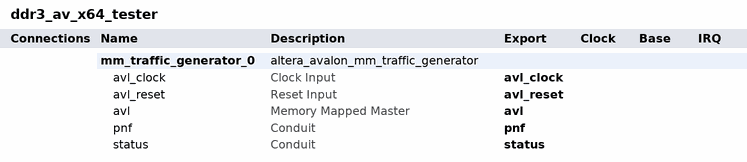
[diagram p0: system contents]
# Platform Designer (Qsys) system ddr3_av_x64_tester, Cyclone V 5CGXFC7D7F31C8
# Parameters at their usual value, and those the tool derives, are not listed.
package require -exact qsys 16.1
create_system ddr3_av_x64_tester
set_project_property DEVICE_FAMILY {Cyclone V}
set_project_property DEVICE 5CGXFC7D7F31C8

add_instance mm_traffic_generator_0 altera_avalon_mm_traffic_generator 16.1
set_instance_property mm_traffic_generator_0 AUTO_EXPORT true
set_instance_parameter_value mm_traffic_generator_0 CUT_NEW_FAMILY_TIMING true
set_instance_parameter_value mm_traffic_generator_0 DISABLE_CHILD_MESSAGING false
set_instance_parameter_value mm_traffic_generator_0 ENABLE_CTRL_AVALON_INTERFACE true
set_instance_parameter_value mm_traffic_generator_0 ENABLE_EMIT_BFM_MASTER false
set_instance_parameter_value mm_traffic_generator_0 HARD_EMIF false
set_instance_parameter_value mm_traffic_generator_0 HHP_HPS false
set_instance_parameter_value mm_traffic_generator_0 HHP_HPS_SIMULATION false
set_instance_parameter_value mm_traffic_generator_0 HHP_HPS_VERIFICATION false
set_instance_parameter_value mm_traffic_generator_0 HPS_PROTOCOL DEFAULT
set_instance_parameter_value mm_traffic_generator_0 IS_ES_DEVICE false
set_instance_parameter_value mm_traffic_generator_0 PARSE_FRIENDLY_DEVICE_FAMILY_PARAM_VALID false
set_instance_parameter_value mm_traffic_generator_0 SPEED_GRADE 2
set_instance_parameter_value mm_traffic_generator_0 TG_AVL_ADDR_WIDTH_IN 23
set_instance_parameter_value mm_traffic_generator_0 TG_AVL_DATA_WIDTH_IN 64
set_instance_parameter_value mm_traffic_generator_0 TG_AVL_MAX_SIZE 2
set_instance_parameter_value mm_traffic_generator_0 TG_AVL_SYMBOL_WIDTH 8
set_instance_parameter_value mm_traffic_generator_0 TG_BLOCK_RW_BLOCK_SIZE 8
set_instance_parameter_value mm_traffic_generator_0 TG_BLOCK_RW_RAND_ADDR_COUNT 8
set_instance_parameter_value mm_traffic_generator_0 TG_BLOCK_RW_RAND_SEQ_ADDR_COUNT 8
set_instance_parameter_value mm_traffic_generator_0 TG_BLOCK_RW_SEQ_ADDR_COUNT 8
set_instance_parameter_value mm_traffic_generator_0 TG_BURST_BEGIN true
set_instance_parameter_value mm_traffic_generator_0 TG_BURST_ON_BURST_BOUNDARY false
set_instance_parameter_value mm_traffic_generator_0 TG_BYTE_ENABLE true
set_instance_parameter_value mm_traffic_generator_0 TG_DO_NOT_CROSS_4KB_BOUNDARY false
set_instance_parameter_value mm_traffic_generator_0 TG_ENABLE_DRIVER_CSR_MASTER false
set_instance_parameter_value mm_traffic_generator_0 TG_ENABLE_READ_COMPARE true
set_instance_parameter_value mm_traffic_generator_0 TG_ENABLE_UNIX_ID false
set_instance_parameter_value mm_traffic_generator_0 TG_GEN_BYTE_ADDR true
set_instance_parameter_value mm_traffic_generator_0 TG_MAX_READ_LATENCY 20
set_instance_parameter_value mm_traffic_generator_0 TG_NUM_DRIVER_LOOP 1000
set_instance_parameter_value mm_traffic_generator_0 TG_PNF_ENABLE true
set_instance_parameter_value mm_traffic_generator_0 TG_POWER_OF_TWO_BURSTS_ONLY false
set_instance_parameter_value mm_traffic_generator_0 TG_POWER_OF_TWO_BUS false
set_instance_parameter_value mm_traffic_generator_0 TG_RANDOM_BYTE_ENABLE false
set_instance_parameter_value mm_traffic_generator_0 TG_RAND_ADDR_GEN_MIN_BURSTCOUNT 1
set_instance_parameter_value mm_traffic_generator_0 TG_RAND_SEQ_ADDR_GEN_MIN_BURSTCOUNT 1
set_instance_parameter_value mm_traffic_generator_0 TG_RAND_SEQ_ADDR_GEN_RAND_ADDR_PERCENT 50
set_instance_parameter_value mm_traffic_generator_0 TG_SEQ_ADDR_GEN_MIN_BURSTCOUNT 1
set_instance_parameter_value mm_traffic_generator_0 TG_SINGLE_RW_RAND_ADDR_COUNT 32
set_instance_parameter_value mm_traffic_generator_0 TG_SINGLE_RW_RAND_SEQ_ADDR_COUNT 32
set_instance_parameter_value mm_traffic_generator_0 TG_SINGLE_RW_SEQ_ADDR_COUNT 32
set_instance_parameter_value mm_traffic_generator_0 TG_SOPC_COMPAT_RESET false
set_instance_parameter_value mm_traffic_generator_0 TG_TEMPLATE_STAGE_COUNT 4
set_instance_parameter_value mm_traffic_generator_0 TG_TIMEOUT_COUNTER_WIDTH 32
set_instance_parameter_value mm_traffic_generator_0 TG_TWO_AVL_INTERFACES false
set_instance_parameter_value mm_traffic_generator_0 TG_USE_LITE_DRIVER false
set_instance_parameter_value mm_traffic_generator_0 TG_USE_UNIX_ID 0

# exported interfaces
add_interface avl avalon master
set_interface_property avl EXPORT_OF mm_traffic_generator_0.avl
add_interface avl_clock clock sink
set_interface_property avl_clock EXPORT_OF mm_traffic_generator_0.avl_clock
add_interface avl_reset reset sink
set_interface_property avl_reset EXPORT_OF mm_traffic_generator_0.avl_reset
add_interface pnf conduit end
set_interface_property pnf EXPORT_OF mm_traffic_generator_0.pnf
add_interface status conduit end
set_interface_property status EXPORT_OF mm_traffic_generator_0.status

set_interconnect_requirement {$system} qsys_mm.clockCrossingAdapter HANDSHAKE
set_interconnect_requirement {$system} qsys_mm.enableEccProtection FALSE
set_interconnect_requirement {$system} qsys_mm.insertDefaultSlave FALSE
set_interconnect_requirement {$system} qsys_mm.maxAdditionalLatency 1

save_system ddr3_av_x64_tester.qsys
